# Altium project WatchDawg.PrjPCB
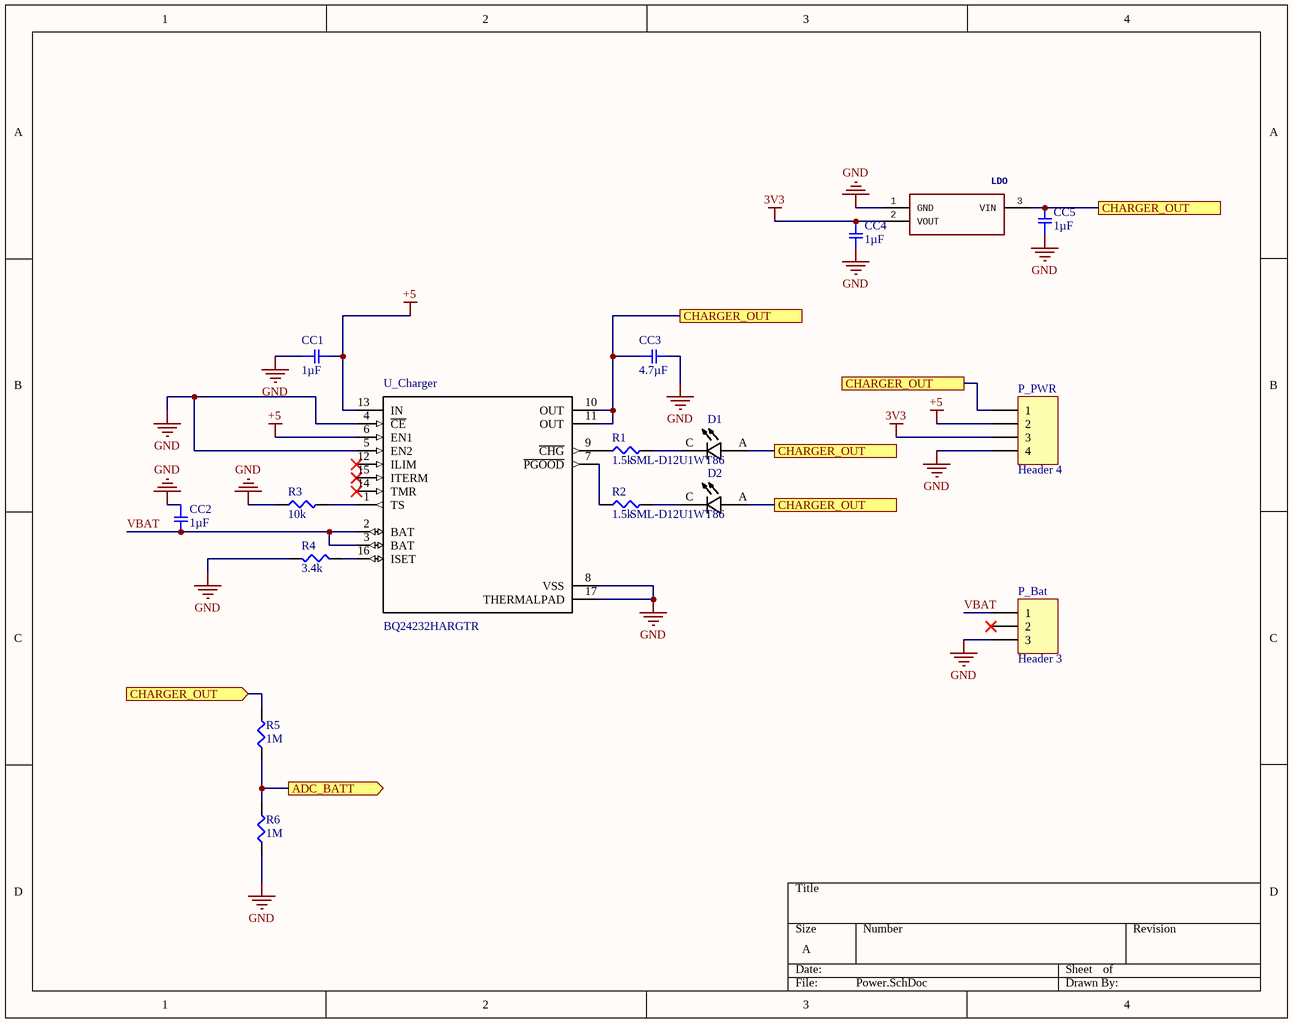
[diagram p0: Power.SchDoc]
6 sheets, 46 parts. Net scope: flat (ports and power ports of the same name join across sheets).
Board file: Board.PcbDoc
Sheets:
  Power.SchDoc
  MSP430.SchDoc
  Magnetometer.SchDoc
  EPaper.SchDoc
  GPS.SchDoc
  USB-FTDI.SchDoc

## Sheet Power.SchDoc
size A

### Parts
CC1  1µF  [SMD-0603C]
CC2  1µF  [SMD-0603C]
CC3  4.7µF  [SMD-0603C]
CC4  1µF  [SMD-0603C]
CC5  1µF  [SMD-0603C]
D1  SML-D12U1WT86  [*LED_SML-D12Y1WT86_SML-D12U1WT86(Primary)]
D2  SML-D12U1WT86  [*LED_SML-D12Y1WT86_SML-D12U1WT86(Primary)]
LDO  250mA 3.3V Ultra Low IQ LDO Reg. SOT23 DiodesZetex AP2138N-3.3TRG1, Low Noise LDO Voltage Regulator, 250 (Min)mA, 3.3 V +/-2%, 2.5 to 6.6 Vin, 3-Pin SOT-23Source:  Datasheet  [SOT95P282X145-3N]  (value not drawn)
P_Bat  Header 3  [HDR1X3]
P_PWR  Header 4  [HDR1X4]
R1  1.5k  [SMD-0603-RES]
R2  1.5k  [SMD-0603-RES]
R3  10k  [SMD-0603-RES]
R4  3.4k  [SMD-0603-RES]
R5  1M  [SMD-0603-RES]
R6  1M  [SMD-0603-RES]
U_Charger  BQ24232HARGTR  [*QFN50P300X300X100-17N]

### Ports
ADC_BATT (out), CHARGER_OUT, CHARGER_OUT (in)

### Nets
3V3: CC4.1 LDO.2(VOUT) P_PWR.3
+5: CC1.2 P_PWR.2 U_Charger.6(EN1) U_Charger.13(IN)
GND: CC1.1 CC2.1 CC3.2 CC4.2 CC5.1 LDO.1(GND) P_Bat.3 P_PWR.4 R3.1 R4.2 R6.1 U_Charger.4(~{CE}) U_Charger.5(EN2) U_Charger.8(VSS) U_Charger.17(THERMALPAD)
VBAT: CC2.2 P_Bat.1 U_Charger.2(BAT) U_Charger.3(BAT)
NetCC3_1: CC3.1 CC5.2 D1.A D2.A LDO.3(VIN) P_PWR.1 R5.2 U_Charger.10(OUT) U_Charger.11(OUT) ; port CHARGER_OUT
NetD1_C: D1.C R1.2
NetD2_C: D2.C R2.2
NetR1_1: R1.1 U_Charger.9(~{CHG})
NetR2_1: R2.1 U_Charger.7(~{PGOOD})
NetR3_2: R3.2 U_Charger.1(TS)
NetR4_1: R4.1 U_Charger.16(ISET)
NetR5_1: R5.1 R6.2 ; port ADC_BATT

Not connected (* = marked no-connect by the designer): P_Bat 2*; U_Charger 12(ILIM)* 14(TMR)* 15(ITERM)*

### Library data of the parts
CC1 CC2 CC4 CC5 = GRM188R61A105KA61D: CAP CER 1UF 10V X5R 0603; Manufacturer: Murata Electronics North America; Factory Stock: 0; Unit Price (USD): 0.1; Minimum Quantity: 1; Tolerance: ±10%; Datasheets: http://www.murata.com/~/media/webrenewal/support/library/catalog/products/capacitor/mlcc/c02e.pdf; Image: //media.digikey.com/Renders/Murata%20Renders/ZRB-SERIES-0402.jpg; Digi-Key Part Number: 490-1543-1-ND; Part Number: GRM188R61A105KA61D; Quantity Available: 2638296; @ qty: 0; Packaging: Cut Tape (CT); Series: GRM; Part Status: Active; Value: 1µF; Voltage: 10V; Temperature Coefficient: X5R; Operating Temperature: -55°C ~ 85°C; Features: -; Ratings: -; Applications: General Purpose; Mounting Type: Surface Mount, MLCC; Package / Case: 0603 (1608 Metric); Size / Dimension: 0.063" L x 0.031" W (1.60mm x 0.80mm); Height - Seated (Max): -; Thickness (Max): 0.035" (0.90mm); Lead Spacing: -; Lead Style: -
CC3 = GRM185R60G475ME15D: CAP CER 4.7UF 4V X5R 0603; Manufacturer: Murata Electronics North America; Factory Stock: 0; Unit Price (USD): 0.25; Minimum Quantity: 1; Tolerance: ±20%; Datasheets: http://www.murata.com/~/media/webrenewal/support/library/catalog/products/capacitor/mlcc/c02e.pdf; Image: //media.digikey.com/Renders/Murata%20Renders/ZRB-SERIES-0402.jpg; Digi-Key Part Number: 490-3891-1-ND; Part Number: GRM185R60G475ME15D; Quantity Available: 29936; @ qty: 0; Packaging: Cut Tape (CT); Series: GRM; Part Status: Active; Value: 4.7µF; Voltage: 4V; Temperature Coefficient: X5R; Operating Temperature: -55°C ~ 85°C; Features: -; Ratings: -; Applications: General Purpose; Mounting Type: Surface Mount, MLCC; Package / Case: 0603 (1608 Metric); Size / Dimension: 0.063" L x 0.031" W (1.60mm x 0.80mm); Height - Seated (Max): -; Thickness (Max): 0.020" (0.50mm); Lead Spacing: -; Lead Style: -
D1 D2 = SML-D12U1WT86: SML-D12 Series Red 0603 Diffused 63 mcd 2.2 V Surface Mount LED; MF: Rohm; Digi-Key_Purchase_URL: https://www.digikey.com/product-detail/en/rohm-semiconductor/SML-D12U1WT86/SML-D12U1WT86CT-ND/5843858?utm_source=snapeda&utm_medium=aggregator&utm_campaign=symbol; Digi-Key_Part_Number: SML-D12U1WT86CT-ND; Package: 0603 Rohm; SnapEDA_Link: https://www.snapeda.com/parts/SML-D12U1WT86/Rohm/view-part/?ref=snap; MP: SML-D12U1WT86; Value: *
LDO = AP2138N-3.3TRG1: Manufacturer_Name: Diodes Inc.; GateName_1: G$1; Allied_Number: 70551004; SymbolName_1: AP2138N-3.3TRG1; LibraryName: AP2138N-3.3TRG1; DeviceSetName: AP2138N-3.3TRG1; Package: SOT95P282X145-3N; Manufacturer_Part_Number: AP2138N-3.3TRG1; Mouser_Part_Number: 621-AP2138N-3.3TRG1; Mouser_Price-Stock: https://www.mouser.com/Search/Refine.aspx?Keyword=621-AP2138N-3.3TRG1; RS_Part_Number: 9210398P; RS_Price-Stock: http://uk.rs-online.com/web/p/products/9210398P; Allied_Price-Stock: https://www.alliedelec.com/diodesinc-ap2138n-3-3trg1/70551004/; Height: 1.45mm
P_Bat = Header 3: Header, 3-Pin; LatestRevisionDate: 17-Jul-2002; LatestRevisionNote: Re-released for DXP Platform.; Publisher: Altium Limited
P_PWR = Header 4: Header, 4-Pin; LatestRevisionDate: 17-Jul-2002; LatestRevisionNote: Re-released for DXP Platform.; Publisher: Altium Limited
R1 R2 = ERJ-3EKF1501V: RES SMD 1.5K OHM 1% 1/10W 0603; Manufacturer: Panasonic Electronic Components; Factory Stock: 0; Unit Price (USD): 0.00379; @ qty: 1500; Minimum Quantity: 1; Power (Watts): 0.1W, 1/10W; Temperature Coefficient: ±100ppm/°C; Part Number: ERJ-3EKF1501V; Datasheets: http://industrial.panasonic.com/www-cgi/jvcr13pz.cgi?E+PZ+3+AOA0002+ERJ3EKF1501V+7+WW; Image: //media.digikey.com/Photos/Panasonic%20Photos/MFG_ERJ-P6W%20Series.jpg; Digi-Key Part Number: P1.50KHCT-ND; Quantity Available: 417970; Packaging: Cut Tape (CT); Series: ERJ; Part Status: Active; Value: 1.5k; Tolerance: ±1%; Composition: Thick Film; Features: Automotive AEC-Q200; Operating Temperature: -55°C ~ 155°C; Package / Case: 0603 (1608 Metric); Supplier Device Package: 0603; Size / Dimension: 0.063" L x 0.031" W (1.60mm x 0.80mm); Height - Seated (Max): 0.022" (0.55mm); Number of Terminations: 2; Failure Rate: -
R3 = ERJ-PA3J103V: RES SMD 10K OHM 5% 1/4W 0603; Manufacturer: Panasonic Electronic Components; Factory Stock: 0; Unit Price (USD): 0.01646; @ qty: 1500; Minimum Quantity: 1; Power (Watts): 0.25W, 1/4W; Temperature Coefficient: ±200ppm/°C; Part Number: ERJ-PA3J103V; Datasheets: https://industrial.panasonic.com/cdbs/www-data/pdf/RDA0000/AOA0000C243.pdf; Image: //media.digikey.com/Photos/Panasonic%20Photos/MFG_ERJ-P6W%20Series.jpg; Digi-Key Part Number: P10KBZCT-ND; Quantity Available: 26345; Packaging: Cut Tape (CT); Series: ERJ; Part Status: Active; Value: 10k; Tolerance: ±5%; Composition: Thick Film; Features: Automotive AEC-Q200, Pulse Withstanding; Operating Temperature: -55°C ~ 155°C; Package / Case: 0603 (1608 Metric); Supplier Device Package: 0603; Size / Dimension: 0.063" L x 0.031" W (1.60mm x 0.80mm); Height - Seated (Max): 0.022" (0.55mm); Number of Terminations: 2; Failure Rate: -
R4 = ERJ-3EKF3401V: RES SMD 3.4K OHM 1% 1/10W 0603; Manufacturer: Panasonic Electronic Components; Factory Stock: 0; Unit Price (USD): 0.00379; @ qty: 1500; Minimum Quantity: 1; Power (Watts): 0.1W, 1/10W; Temperature Coefficient: ±100ppm/°C; Part Number: ERJ-3EKF3401V; Datasheets: http://industrial.panasonic.com/www-cgi/jvcr13pz.cgi?E+PZ+3+AOA0002+ERJ3EKF3401V+7+WW; Image: //media.digikey.com/Photos/Panasonic%20Photos/MFG_ERJ-P6W%20Series.jpg; Digi-Key Part Number: P3.40KHCT-ND; Quantity Available: 58954; Packaging: Cut Tape (CT); Series: ERJ; Part Status: Active; Value: 3.4k; Tolerance: ±1%; Composition: Thick Film; Features: Automotive AEC-Q200; Operating Temperature: -55°C ~ 155°C; Package / Case: 0603 (1608 Metric); Supplier Device Package: 0603; Size / Dimension: 0.063" L x 0.031" W (1.60mm x 0.80mm); Height - Seated (Max): 0.022" (0.55mm); Number of Terminations: 2; Failure Rate: -
R5 R6 = ERJ-3EKF1004V: RES SMD 1M OHM 1% 1/10W 0603; Manufacturer: Panasonic Electronic Components; Factory Stock: 0; Unit Price (USD): 0.00379; @ qty: 1500; Minimum Quantity: 1; Power (Watts): 0.1W, 1/10W; Temperature Coefficient: ±100ppm/°C; Part Number: ERJ-3EKF1004V; Datasheets: http://industrial.panasonic.com/www-cgi/jvcr13pz.cgi?E+PZ+3+AOA0002+ERJ3EKF1004V+7+WW; Image: //media.digikey.com/Photos/Panasonic%20Photos/MFG_ERJ-P6W%20Series.jpg; Digi-Key Part Number: P1.00MHCT-ND; Quantity Available: 1632074; Packaging: Cut Tape (CT); Series: ERJ; Part Status: Active; Value: 1M; Tolerance: ±1%; Composition: Thick Film; Features: Automotive AEC-Q200; Operating Temperature: -55°C ~ 155°C; Package / Case: 0603 (1608 Metric); Supplier Device Package: 0603; Size / Dimension: 0.063" L x 0.031" W (1.60mm x 0.80mm); Height - Seated (Max): 0.022" (0.55mm); Number of Terminations: 2; Failure Rate: -
U_Charger = BQ24232HARGTR: USB-Friendly Lithium-Ion Battery Charger and Power-Path Management IC 0.5A 10.5V OVP 16-Pin QFN T/R; MF: Texas Instruments; SnapEDA_Link: https://www.snapeda.com/parts/BQ24232HARGTR/Texas%20Instruments/view-part/?ref=snap; Digi-Key_Part_Number: 296-49554-1-ND; Digi-Key_Purchase_URL: https://www.digikey.com/product-detail/en/texas-instruments/BQ24232HARGTR/296-49554-1-ND/9462552?utm_source=snapeda&utm_medium=aggregator&utm_campaign=symbol; MP: BQ24232HARGTR; Package: VFQFN-16 Texas Instruments; Value: *

## Sheet MSP430.SchDoc
size A
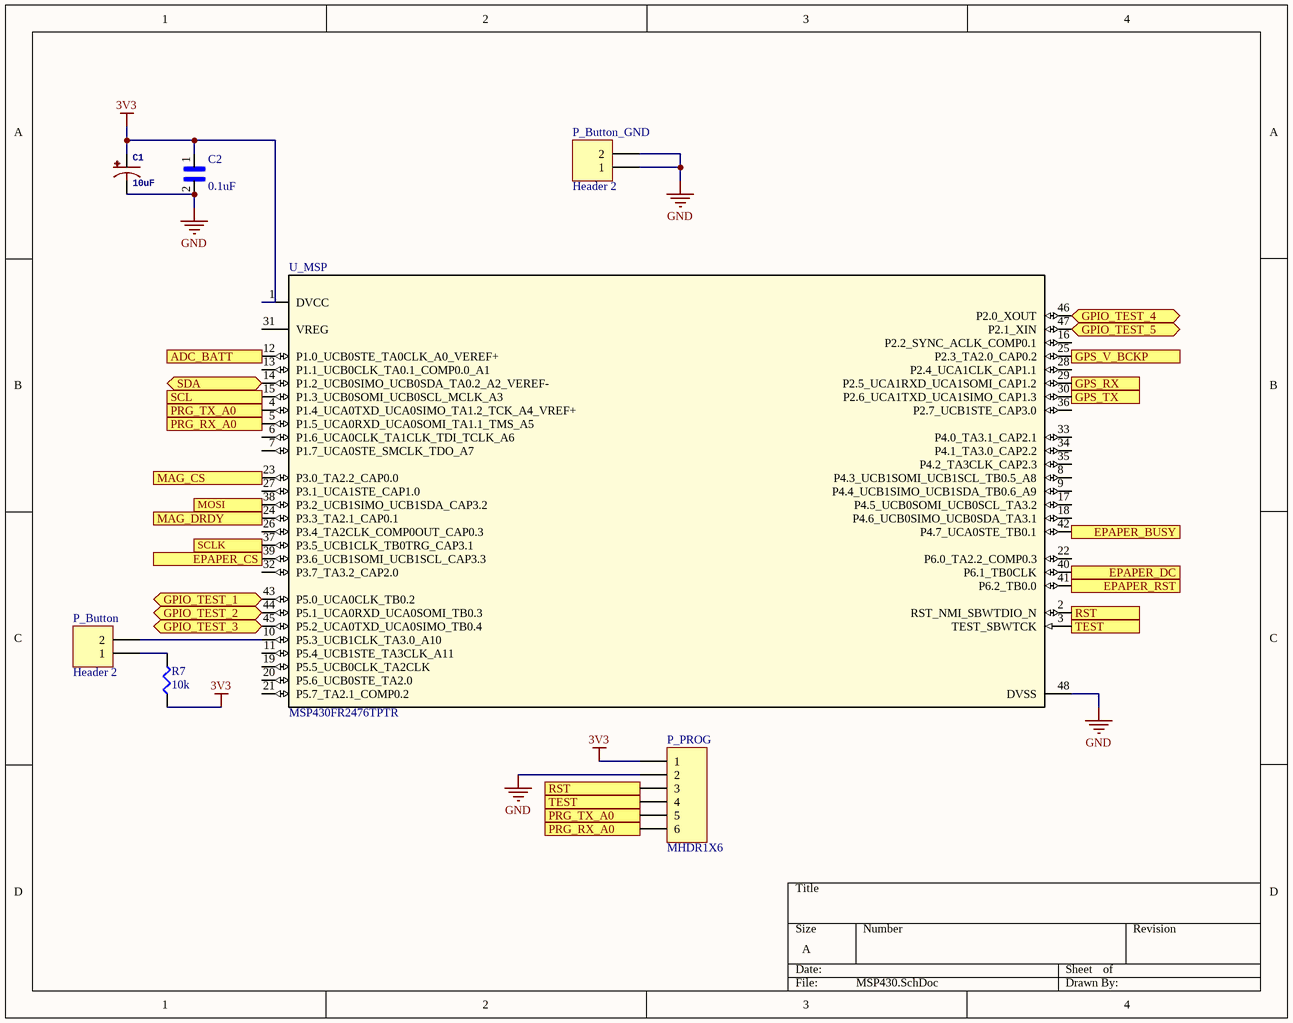
[diagram p1: MSP430.SchDoc]

### Parts
C1  10uF  [0603-POLAR]
C2  0.1uF  [*CAPC1608X90N]
P_Button  Header 2  [HDR1X2]
P_Button_GND  Header 2  [HDR1X2]
P_PROG  MHDR1X6  [MHDR1X6]
R7  10k  [SMD-0603-RES]
U_MSP  MSP430FR2476TPTR  [PT0048A_N]

### Ports
ADC_BATT (in), EPAPER_BUSY (out), EPAPER_CS (out), EPAPER_DC (out), EPAPER_RST (out), GPIO_TEST_1 (bidir), GPIO_TEST_2 (bidir), GPIO_TEST_3 (bidir), GPIO_TEST_4 (bidir), GPIO_TEST_5 (bidir), GPS_RX (in), GPS_TX (out), GPS_V_BCKP (out), MAG_CS (out), MAG_DRDY (out), MOSI (out), PRG_RX_A0 (in), PRG_RX_A0 (out), PRG_TX_A0 (in), PRG_TX_A0 (out), RST (in), RST (out), SCL (out), SCLK (out), SDA (bidir), TEST (in), TEST (out)

### Nets
3V3: C1.+ C2.1 P_PROG.1 R7.1 U_MSP.1(DVCC)
GND: C1.- C2.2 P_Button_GND.1 P_Button_GND.2 P_PROG.2 U_MSP.48(DVSS)
NetGC2_2: U_MSP.25(P2.3_TA2.0_CAP0.2) ; port GPS_V_BCKP
NetGR1_2: U_MSP.30(P2.6_UCA1TXD_UCA1SIMO_CAP1.3) ; port GPS_TX
NetGR2_2: U_MSP.29(P2.5_UCA1RXD_UCA1SOMI_CAP1.2) ; port GPS_RX
NetMR1_1: U_MSP.15(P1.3_UCB0SOMI_UCB0SCL_MCLK_A3) ; port SCL
NetMR2_2: U_MSP.14(P1.2_UCB0SIMO_UCB0SDA_TA0.2_A2_VEREF-) ; port SDA
NetP_Button_1: P_Button.1 R7.2
NetP_Button_2: P_Button.2 U_MSP.10(P5.3_UCB1CLK_TA3.0_A10)
NetP_EPAPER_1: U_MSP.47(P2.1_XIN) ; port GPIO_TEST_5
NetP_EPAPER_2: U_MSP.46(P2.0_XOUT) ; port GPIO_TEST_4
NetP_EPAPER_3: U_MSP.45(P5.2_UCA0TXD_UCA0SIMO_TB0.4) ; port GPIO_TEST_3
NetP_EPAPER_4: U_MSP.44(P5.1_UCA0RXD_UCA0SOMI_TB0.3) ; port GPIO_TEST_2
NetP_EPAPER_5: U_MSP.43(P5.0_UCA0CLK_TB0.2) ; port GPIO_TEST_1
NetP_EPAPER_6: U_MSP.42(P4.7_UCA0STE_TB0.1) ; port EPAPER_BUSY
NetP_EPAPER_7: U_MSP.41(P6.2_TB0.0) ; port EPAPER_RST
NetP_EPAPER_8: U_MSP.40(P6.1_TB0CLK) ; port EPAPER_DC
NetP_EPAPER_9: U_MSP.39(P3.6_UCB1SOMI_UCB1SCL_CAP3.3) ; port EPAPER_CS
NetP_EPAPER_10: U_MSP.37(P3.5_UCB1CLK_TB0TRG_CAP3.1) ; port SCLK
NetP_EPAPER_11: U_MSP.38(P3.2_UCB1SIMO_UCB1SDA_CAP3.2) ; port MOSI
NetP_PROG_3: P_PROG.3 U_MSP.2(RST_NMI_SBWTDIO_N) ; port RST
NetP_PROG_4: P_PROG.4 U_MSP.3(TEST_SBWTCK) ; port TEST
NetP_PROG_5: P_PROG.5 U_MSP.4(P1.4_UCA0TXD_UCA0SIMO_TA1.2_TCK_A4_VREF+) ; port PRG_TX_A0
NetP_PROG_6: P_PROG.6 U_MSP.5(P1.5_UCA0RXD_UCA0SOMI_TA1.1_TMS_A5) ; port PRG_RX_A0
NetR5_1: U_MSP.12(P1.0_UCB0STE_TA0CLK_A0_VEREF+) ; port ADC_BATT
NetU_MAG_8: U_MSP.24(P3.3_TA2.1_CAP0.1) ; port MAG_DRDY
NetU_MAG_10: U_MSP.23(P3.0_TA2.2_CAP0.0) ; port MAG_CS

Not connected (* = marked no-connect by the designer): U_MSP 6(P1.6_UCA0CLK_TA1CLK_TDI_TCLK_A6) 7(P1.7_UCA0STE_SMCLK_TDO_A7) 8(P4.3_UCB1SOMI_UCB1SCL_TB0.5_A8) 9(P4.4_UCB1SIMO_UCB1SDA_TB0.6_A9) 11(P5.4_UCB1STE_TA3CLK_A11) 13(P1.1_UCB0CLK_TA0.1_COMP0.0_A1) 16(P2.2_SYNC_ACLK_COMP0.1) 17(P4.5_UCB0SOMI_UCB0SCL_TA3.2) 18(P4.6_UCB0SIMO_UCB0SDA_TA3.1) 19(P5.5_UCB0CLK_TA2CLK) 20(P5.6_UCB0STE_TA2.0) 21(P5.7_TA2.1_COMP0.2) 22(P6.0_TA2.2_COMP0.3) 26(P3.4_TA2CLK_COMP0OUT_CAP0.3) 27(P3.1_UCA1STE_CAP1.0) 28(P2.4_UCA1CLK_CAP1.1) 31(VREG) 32(P3.7_TA3.2_CAP2.0) 33(P4.0_TA3.1_CAP2.1) 34(P4.1_TA3.0_CAP2.2) 35(P4.2_TA3CLK_CAP2.3) 36(P2.7_UCB1STE_CAP3.0)

### Library data of the parts
C1 = 10UF-POLAR-0603-6.3V-20%(TANT): GateName_1: G$1; SymbolName_1: CAP_POL; PROD_ID: CAP-13210; DeviceName: -0603-6.3V-20%(TANT); LibraryName: SparkFun-Capacitors; DeviceSetName: 10UF-POLAR; Package: 0603-POLAR
C2 = GMK107BJ104KAHT: CAP , MLCC , 0603, 35V , X5R, 0.1uF10% , T&R; MF: Taiyo Yuden; Package: 1608 Taiyo Yuden; Digi-Key_Purchase_URL: https://www.digikey.com/product-detail/en/taiyo-yuden/GMK107BJ104KAHT/587-3357-1-ND/4157244?utm_source=snapeda&utm_medium=aggregator&utm_campaign=symbol; Digi-Key_Part_Number: 587-3357-1-ND; SnapEDA_Link: https://www.snapeda.com/parts/GMK107BJ104KAHT/Taiyo%20Yuden/view-part/?ref=snap; MP: GMK107BJ104KAHT; Value: *
P_Button P_Button_GND = Header 2: Header, 2-Pin; LatestRevisionDate: 17-Jul-2002; LatestRevisionNote: Re-released for DXP Platform.; Publisher: Altium Limited
P_PROG = MHDR1X6: Header, 6-Pin; LatestRevisionDate: 17-Jul-2002; LatestRevisionNote: Re-released for DXP Platform.; Publisher: Altium Limited
R7 = ERJ-PA3F1002V: RES SMD 10K OHM 1% 1/4W 0603; Manufacturer: Panasonic Electronic Components; Factory Stock: 0; Unit Price (USD): 0.02372; @ qty: 1500; Minimum Quantity: 1; Power (Watts): 0.25W, 1/4W; Temperature Coefficient: ±100ppm/°C; Part Number: ERJ-PA3F1002V; Datasheets: https://industrial.panasonic.com/cdbs/www-data/pdf/RDA0000/AOA0000C243.pdf; Image: //media.digikey.com/Photos/Panasonic%20Photos/MFG_ERJ-P6W%20Series.jpg; Digi-Key Part Number: P10KBYCT-ND; Quantity Available: 12488; Packaging: Cut Tape (CT); Series: ERJ; Part Status: Active; Value: 10k; Tolerance: ±1%; Composition: Thick Film; Features: Automotive AEC-Q200, Pulse Withstanding; Operating Temperature: -55°C ~ 155°C; Package / Case: 0603 (1608 Metric); Supplier Device Package: 0603; Size / Dimension: 0.063" L x 0.031" W (1.60mm x 0.80mm); Height - Seated (Max): 0.022" (0.55mm); Number of Terminations: 2; Failure Rate: -
U_MSP = MSP430FR2476TPTR: Imported; Manufacturer: Texas Instruments; PartNumber: MSP430FR2476TPTR; RefDes: RefDes; TYPE: TYPE; Value: Value

## Sheet Magnetometer.SchDoc
size A
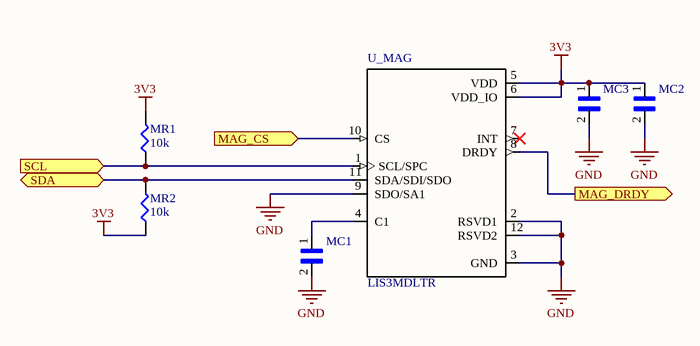
[diagram p2: Magnetometer.SchDoc]

### Parts
MC1  GMK107BJ104KAHT  [*CAPC1608X90N]  (value not drawn)
MC2  TACL105K016XTA  [*CAPC1608X90]  (value not drawn)
MC3  GMK107BJ104KAHT  [*CAPC1608X90N]  (value not drawn)
MR1  10k  [SMD-0603-RES]
MR2  10k  [SMD-0603-RES]
U_MAG  LIS3MDLTR  [*XDCR_LIS3MDLTR]

### Ports
MAG_CS (in), MAG_DRDY (out), SCL (in), SDA (bidir)

### Nets
3V3: MC2.1 MC3.1 MR1.2 MR2.1 U_MAG.5(VDD) U_MAG.6(VDD_IO)
GND: MC1.2 MC2.2 MC3.2 U_MAG.2(RSVD1) U_MAG.3(GND) U_MAG.9(SDO/SA1) U_MAG.12(RSVD2)
NetMC1_1: MC1.1 U_MAG.4(C1)
NetMR1_1: MR1.1 U_MAG.1(SCL/SPC) ; port SCL
NetMR2_2: MR2.2 U_MAG.11(SDA/SDI/SDO) ; port SDA
NetU_MAG_8: U_MAG.8(DRDY) ; port MAG_DRDY
NetU_MAG_10: U_MAG.10(CS) ; port MAG_CS

Not connected (* = marked no-connect by the designer): U_MAG 7(INT)*

### Library data of the parts
MC1 MC3 = GMK107BJ104KAHT: as C2 on sheet MSP430; Package: 1608 Taiyo Yuden; Digi-Key_Purchase_URL: https://www.digikey.com/product-detail/en/taiyo-yuden/GMK107BJ104KAHT/587-3357-1-ND/4157244?utm_source=snapeda&utm_medium=aggregator&utm_campaign=symbol; Digi-Key_Part_Number: 587-3357-1-ND; SnapEDA_Link: https://www.snapeda.com/parts/GMK107BJ104KAHT/Taiyo%20Yuden/view-part/?ref=snap; MP: GMK107BJ104KAHT; Value: *
MC2 = TACL105K016XTA: Cap Tant Solid 1uF 16V L CASE 10% _1.6 X 0.85 X 0.85mm_ SMD 1608-10 7.5 Ohm 125Â°C Plastic T/R; MF: AVX; Digi-Key_Purchase_URL: https://www.digikey.com/product-detail/en/avx-corporation/TACL105K016XTA/478-4184-1-ND/1212747?utm_source=snapeda&utm_medium=aggregator&utm_campaign=symbol; Digi-Key_Part_Number: 478-4184-1-ND; Package: 0603 AVX; SnapEDA_Link: https://www.snapeda.com/parts/TACL105K016XTA/AVX%20/%20Kyocera/view-part/?ref=snap; MP: TACL105K016XTA; Value: *
MR1 MR2 = ERJ-PA3J103V: as R3 on sheet Power; Part Number: ERJ-PA3J103V; Datasheets: https://industrial.panasonic.com/cdbs/www-data/pdf/RDA0000/AOA0000C243.pdf; Image: //media.digikey.com/Photos/Panasonic%20Photos/MFG_ERJ-P6W%20Series.jpg; Digi-Key Part Number: P10KBZCT-ND; Quantity Available: 26345; Packaging: Cut Tape (CT); Series: ERJ; Part Status: Active; Value: 10k; Tolerance: ±5%; Composition: Thick Film; Features: Automotive AEC-Q200, Pulse Withstanding; Operating Temperature: -55°C ~ 155°C; Package / Case: 0603 (1608 Metric); Supplier Device Package: 0603; Size / Dimension: 0.063" L x 0.031" W (1.60mm x 0.80mm); Height - Seated (Max): 0.022" (0.55mm); Number of Terminations: 2; Failure Rate: -
U_MAG = LIS3MDLTR: LIS3MDL Series 3 Axis Â±2/Â±8/Â±12/Â±16 g 3.6V High Performance Magnetometer LGA-12; MF: STMicroelectronics; SnapEDA_Link: https://www.snapeda.com/parts/LIS3MDLTR/STMicroelectronics/view-part/?ref=snap; Digi-Key_Part_Number: 497-13892-1-ND; Digi-Key_Purchase_URL: https://www.digikey.com/product-detail/en/stmicroelectronics/LIS3MDLTR/497-13892-1-ND/4309737?utm_source=snapeda&utm_medium=aggregator&utm_campaign=symbol; Package: VFLGA-12 STMicroelectronics; MP: LIS3MDLTR; Value: *

## Sheet EPaper.SchDoc
size A
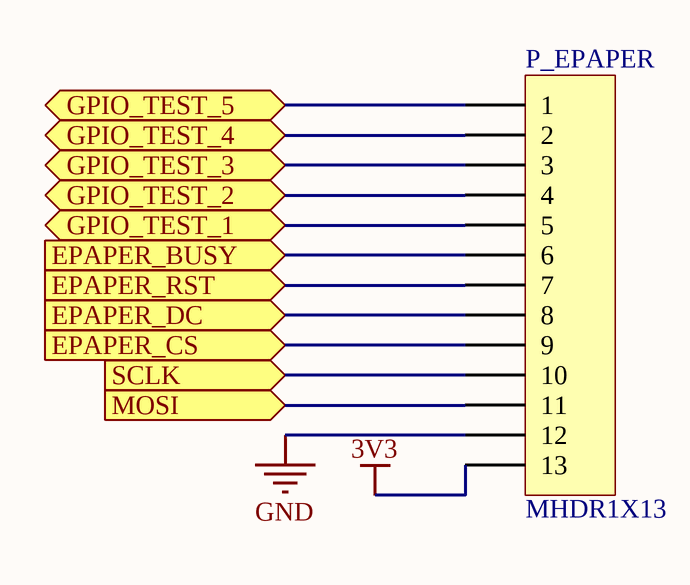
[diagram p3: EPaper.SchDoc]

### Parts
P_EPAPER  MHDR1X13  [MHDR1X13]

### Ports
EPAPER_BUSY (in), EPAPER_CS (in), EPAPER_DC (in), EPAPER_RST (in), GPIO_TEST_1 (bidir), GPIO_TEST_2 (bidir), GPIO_TEST_3 (bidir), GPIO_TEST_4 (bidir), GPIO_TEST_5 (bidir), MOSI (in), SCLK (in)

### Nets
3V3: P_EPAPER.13
GND: P_EPAPER.12
NetP_EPAPER_1: P_EPAPER.1 ; port GPIO_TEST_5
NetP_EPAPER_2: P_EPAPER.2 ; port GPIO_TEST_4
NetP_EPAPER_3: P_EPAPER.3 ; port GPIO_TEST_3
NetP_EPAPER_4: P_EPAPER.4 ; port GPIO_TEST_2
NetP_EPAPER_5: P_EPAPER.5 ; port GPIO_TEST_1
NetP_EPAPER_6: P_EPAPER.6 ; port EPAPER_BUSY
NetP_EPAPER_7: P_EPAPER.7 ; port EPAPER_RST
NetP_EPAPER_8: P_EPAPER.8 ; port EPAPER_DC
NetP_EPAPER_9: P_EPAPER.9 ; port EPAPER_CS
NetP_EPAPER_10: P_EPAPER.10 ; port SCLK
NetP_EPAPER_11: P_EPAPER.11 ; port MOSI

### Library data of the parts
P_EPAPER = MHDR1X13: Header, 13-Pin; LatestRevisionDate: 17-Jul-2002; LatestRevisionNote: Re-released for DXP Platform.; Publisher: Altium Limited

## Sheet GPS.SchDoc
size A
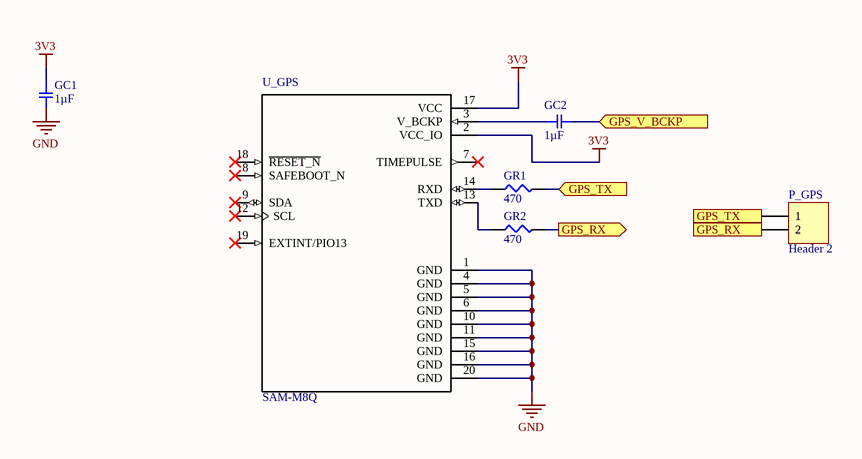
[diagram p4: GPS.SchDoc]

### Parts
GC1  1µF  [SMD-0603C]
GC2  1µF  [SMD-0603C]
GR1  470  [SMD-0603-RES]
GR2  470  [SMD-0603-RES]
P_GPS  Header 2  [HDR1X2]
U_GPS  SAM-M8Q  [*XCVR_SAM-M8Q]

### Ports
GPS_RX (out), GPS_TX (in), GPS_TX (out), GPS_V_BCKP (in)

### Nets
3V3: GC1.1 U_GPS.2(VCC_IO) U_GPS.17(VCC)
GND: GC1.2 U_GPS.1(GND) U_GPS.4(GND) U_GPS.5(GND) U_GPS.6(GND) U_GPS.10(GND) U_GPS.11(GND) U_GPS.15(GND) U_GPS.16(GND) U_GPS.20(GND)
NetGC2_1: GC2.1 U_GPS.3(V_BCKP)
NetGC2_2: GC2.2 ; port GPS_V_BCKP
NetGR1_1: GR1.1 U_GPS.14(RXD)
NetGR1_2: GR1.2 P_GPS.1 ; port GPS_TX
NetGR2_1: GR2.1 U_GPS.13(TXD)
NetGR2_2: GR2.2 P_GPS.2 ; port GPS_RX

Not connected (* = marked no-connect by the designer): U_GPS 7(TIMEPULSE)* 8(SAFEBOOT_N)* 9(SDA)* 12(SCL)* 18(~{RESET_N})* 19(EXTINT/PIO13)*

### Library data of the parts
GC1 GC2 = GRM188R61A105KA61D: as CC1 on sheet Power; Datasheets: http://www.murata.com/~/media/webrenewal/support/library/catalog/products/capacitor/mlcc/c02e.pdf; Image: //media.digikey.com/Renders/Murata%20Renders/ZRB-SERIES-0402.jpg; Digi-Key Part Number: 490-1543-1-ND; Part Number: GRM188R61A105KA61D; Quantity Available: 2638296; @ qty: 0; Packaging: Cut Tape (CT); Series: GRM; Part Status: Active; Value: 1µF; Voltage: 10V; Temperature Coefficient: X5R; Operating Temperature: -55°C ~ 85°C; Features: -; Ratings: -; Applications: General Purpose; Mounting Type: Surface Mount, MLCC; Package / Case: 0603 (1608 Metric); Size / Dimension: 0.063" L x 0.031" W (1.60mm x 0.80mm); Height - Seated (Max): -; Thickness (Max): 0.035" (0.90mm); Lead Spacing: -; Lead Style: -
GR1 GR2 = ERJ-3EKF4700V: RES SMD 470 OHM 1% 1/10W 0603; Manufacturer: Panasonic Electronic Components; Factory Stock: 0; Unit Price (USD): 0.00379; @ qty: 1500; Minimum Quantity: 1; Power (Watts): 0.1W, 1/10W; Temperature Coefficient: ±100ppm/°C; Part Number: ERJ-3EKF4700V; Datasheets: http://industrial.panasonic.com/www-cgi/jvcr13pz.cgi?E+PZ+3+AOA0002+ERJ3EKF4700V+7+WW; Image: //media.digikey.com/Photos/Panasonic%20Photos/MFG_ERJ-P6W%20Series.jpg; Digi-Key Part Number: P470HCT-ND; Quantity Available: 553629; Packaging: Cut Tape (CT); Series: ERJ; Part Status: Active; Value: 470; Tolerance: ±1%; Composition: Thick Film; Features: Automotive AEC-Q200; Operating Temperature: -55°C ~ 155°C; Package / Case: 0603 (1608 Metric); Supplier Device Package: 0603; Size / Dimension: 0.063" L x 0.031" W (1.60mm x 0.80mm); Height - Seated (Max): 0.022" (0.55mm); Number of Terminations: 2; Failure Rate: -
P_GPS = Header 2: Header, 2-Pin; LatestRevisionDate: 17-Jul-2002; LatestRevisionNote: Re-released for DXP Platform.; Publisher: Altium Limited
U_GPS = SAM-M8Q: u-Blox M8 Gnss Antenna Module; MF: U-Blox America; Digi-Key_Purchase_URL: https://www.digikey.com/product-detail/en/u-blox-america-inc/SAM-M8Q-0-10/672-1054-1-ND/7393573?utm_source=snapeda&utm_medium=aggregator&utm_campaign=symbol; Package: SMD-20 U-Blox America; MP: SAM-M8Q; SnapEDA_Link: https://www.snapeda.com/parts/SAM-M8Q/U-Blox%20America%20Inc./view-part/?ref=snap; Digi-Key_Part_Number: 672-1054-1-ND; Value: *

## Sheet USB-FTDI.SchDoc
size A
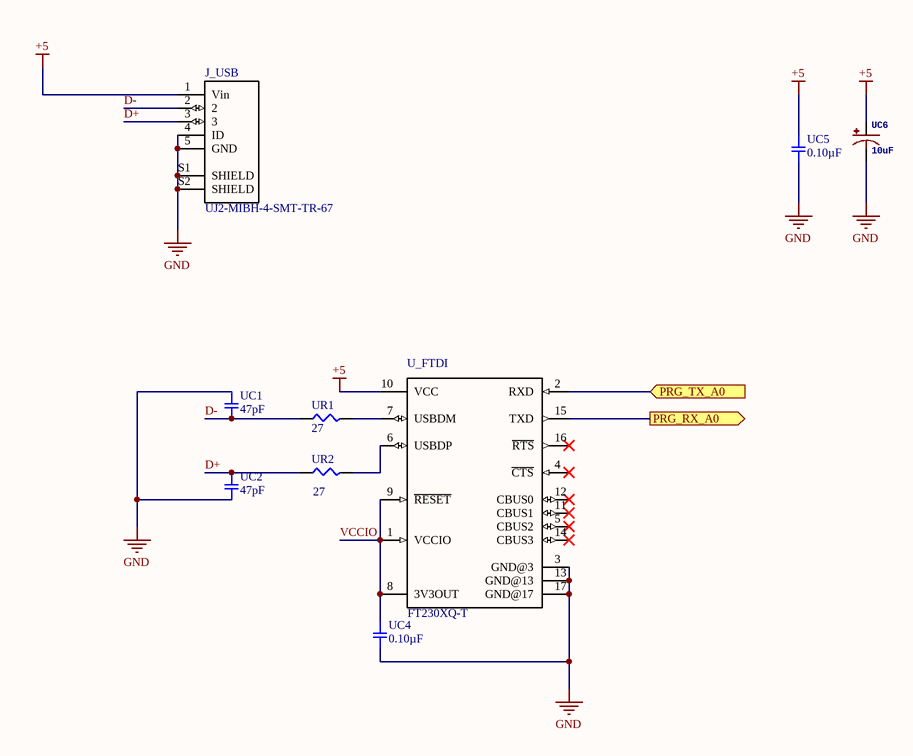
[diagram p5: USB-FTDI.SchDoc]

### Parts
J_USB  UJ2-MIBH-4-SMT-TR-67  [*CUI_UJ2-MIBH-4-SMT-TR-67_UJ2-MIBH-4-SMT-TR-67(Primary)]
U_FTDI  FT230XQ-T  [*QFN16]
UC1  47pF  [SMD-0603C]
UC2  47pF  [SMD-0603C]
UC4  0.10µF  [SMD-0603C]
UC5  0.10µF  [SMD-0603C]
UC6  10uF  [0603-POLAR]
UR1  27  [SMD-0603-RES]
UR2  27  [SMD-0603-RES]

### Ports
PRG_RX_A0 (out), PRG_TX_A0 (in)

### Nets
+5: J_USB.1(Vin) U_FTDI.10(VCC) UC5.1 UC6.+
GND: J_USB.4(ID) J_USB.5(GND) J_USB.S1(SHIELD) J_USB.S2(SHIELD) U_FTDI.3(GND@3) U_FTDI.13(GND@13) U_FTDI.17(GND@17) UC1.1 UC2.2 UC4.2 UC5.2 UC6.-
D+: J_USB.3 UC2.1 UR2.1
D-: J_USB.2 UC1.2 UR1.1
VCCIO: U_FTDI.1(VCCIO) U_FTDI.8(3V3OUT) U_FTDI.9(~{RESET}) UC4.1
NetP_PROG_5: U_FTDI.2(RXD) ; port PRG_TX_A0
NetP_PROG_6: U_FTDI.15(TXD) ; port PRG_RX_A0
NetU_FTDI_6: U_FTDI.6(USBDP) UR2.2
NetU_FTDI_7: U_FTDI.7(USBDM) UR1.2

Not connected (* = marked no-connect by the designer): U_FTDI 4(~{CTS})* 5(CBUS2)* 11(CBUS1)* 12(CBUS0)* 14(CBUS3)* 16(~{RTS})*

### Library data of the parts
J_USB = UJ2-MIBH-4-SMT-TR-67: Micro B, USB 2.0, 1.8 A, Right Angle, Surface Mount _SMT_, Waterproof, USB Receptacle; MF: CUI Devices; Digi-Key_Purchase_URL: https://www.digikey.com/product-detail/en/cui-devices/UJ2-MIBH-4-SMT-TR-67/102-4970-1-ND/9564435?utm_source=snapeda&utm_medium=aggregator&utm_campaign=symbol; CUI_purchase_URL: https://www.cuidevices.com/product/interconnect/connectors/usb-connectors/uj2-mibh-4-smt-tr-67?utm_source=snapeda.com&utm_medium=referral&utm_campaign=snapedaBOM; Package: None; MP: UJ2-MIBH-4-SMT-TR-67; SnapEDA_Link: https://www.snapeda.com/parts/UJ2-MIBH-4-SMT-TR-67/CUI%20Devices/view-part/?ref=snap; Digi-Key_Part_Number: 102-4970-1-ND; Value: *
U_FTDI = FT230XQ-T: USB Full Speed to Basic UART IC with USB Charger Detection, QFN-16; MF: FTDI,; MP: FT230XQ-T; Digi-Key_Purchase_URL: https://www.digikey.com/product-detail/en/ftdi-future-technology-devices-international-ltd/FT230XQ-T/768-1153-ND/3749474?utm_source=snapeda&utm_medium=aggregator&utm_campaign=symbol; Package: QFN-16 FTDI; SnapEDA_Link: https://www.snapeda.com/parts/FT230XQ-T/FTDI%2C%20Future%20Technology%20Devices%20International%20Ltd/view-part/?ref=snap; Digi-Key_Part_Number: 768-1153-ND; Value: *
UC1 UC2 = GCM1885C2A470JA16D: CAP CER 47PF 100V NP0 0603; Manufacturer: Murata Electronics North America; Factory Stock: 0; Unit Price (USD): 0.1; Minimum Quantity: 1; Tolerance: ±5%; Temperature Coefficient: C0G, NP0; Datasheets: http://www.murata.com/~/media/webrenewal/support/library/catalog/products/capacitor/mlcc/c03e.ashx; Image: //media.digikey.com/Renders/Murata%20Renders/0603%28GCM188%29.jpg; Digi-Key Part Number: 490-4944-1-ND; Part Number: GCM1885C2A470JA16D; Quantity Available: 586; @ qty: 0; Packaging: Cut Tape (CT); Series: GCM; Part Status: Active; Value: 47pF; Voltage: 100V; Operating Temperature: -55°C ~ 125°C; Features: -; Ratings: AEC-Q200; Applications: Automotive; Mounting Type: Surface Mount, MLCC; Package / Case: 0603 (1608 Metric); Size / Dimension: 0.063" L x 0.031" W (1.60mm x 0.80mm); Height - Seated (Max): -; Thickness (Max): 0.035" (0.90mm); Lead Spacing: -; Lead Style: -
UC4 UC5 = GCM188R71C104KA37D: CAP CER 0.1UF 16V X7R 0603; Manufacturer: Murata Electronics North America; Factory Stock: 0; Unit Price (USD): 0.18; Minimum Quantity: 1; Tolerance: ±10%; Datasheets: http://www.murata.com/~/media/webrenewal/support/library/catalog/products/capacitor/mlcc/c03e.ashx; Image: //media.digikey.com/Renders/Murata%20Renders/0603%28GCM188%29.jpg; Digi-Key Part Number: 490-4774-1-ND; Part Number: GCM188R71C104KA37D; Quantity Available: 284085; @ qty: 0; Packaging: Cut Tape (CT); Series: GCM; Part Status: Active; Value: 0.10µF; Voltage: 16V; Temperature Coefficient: X7R; Operating Temperature: -55°C ~ 125°C; Features: -; Ratings: AEC-Q200; Applications: Automotive; Mounting Type: Surface Mount, MLCC; Package / Case: 0603 (1608 Metric); Size / Dimension: 0.063" L x 0.031" W (1.60mm x 0.80mm); Height - Seated (Max): -; Thickness (Max): 0.035" (0.90mm); Lead Spacing: -; Lead Style: -
UC6 = 10UF-POLAR-0603-6.3V-20%(TANT): as C1 on sheet MSP430; DeviceName: -0603-6.3V-20%(TANT); LibraryName: SparkFun-Capacitors; DeviceSetName: 10UF-POLAR; Package: 0603-POLAR
UR1 UR2 = ERJ-3EKF27R0V: RES SMD 27 OHM 1% 1/10W 0603; Manufacturer: Panasonic Electronic Components; Factory Stock: 0; Unit Price (USD): 0.00379; @ qty: 1500; Minimum Quantity: 1; Power (Watts): 0.1W, 1/10W; Temperature Coefficient: ±100ppm/°C; Part Number: ERJ-3EKF27R0V; Datasheets: http://industrial.panasonic.com/www-cgi/jvcr13pz.cgi?E+PZ+3+AOA0002+ERJ3EKF27R0V+7+WW; Image: //media.digikey.com/Photos/Panasonic%20Photos/MFG_ERJ-P6W%20Series.jpg; Digi-Key Part Number: P27.0HCT-ND; Quantity Available: 283006; Packaging: Cut Tape (CT); Series: ERJ; Part Status: Active; Value: 27; Tolerance: ±1%; Composition: Thick Film; Features: Automotive AEC-Q200; Operating Temperature: -55°C ~ 155°C; Package / Case: 0603 (1608 Metric); Supplier Device Package: 0603; Size / Dimension: 0.063" L x 0.031" W (1.60mm x 0.80mm); Height - Seated (Max): 0.022" (0.55mm); Number of Terminations: 2; Failure Rate: -

## Nets that join several sheets
3V3: Power (CC4.1 LDO.2 P_PWR.3), MSP430 (5 pins), Magnetometer (6 pins), EPaper (P_EPAPER.13), GPS (GC1.1 U_GPS.2 U_GPS.17)
+5: Power (CC1.2 P_PWR.2 U_Charger.6 U_Charger.13), USB-FTDI (J_USB.1 U_FTDI.10 UC5.1 UC6.+)
GND: Power (15 pins), MSP430 (6 pins), Magnetometer (7 pins), EPaper (P_EPAPER.12), GPS (10 pins), USB-FTDI (12 pins)
NetGC2_2: MSP430 (U_MSP.25), GPS (GC2.2)
NetGR1_2: MSP430 (U_MSP.30), GPS (GR1.2 P_GPS.1)
NetGR2_2: MSP430 (U_MSP.29), GPS (GR2.2 P_GPS.2)
NetMR1_1: MSP430 (U_MSP.15), Magnetometer (MR1.1 U_MAG.1)
NetMR2_2: MSP430 (U_MSP.14), Magnetometer (MR2.2 U_MAG.11)
NetP_EPAPER_1: MSP430 (U_MSP.47), EPaper (P_EPAPER.1)
NetP_EPAPER_2: MSP430 (U_MSP.46), EPaper (P_EPAPER.2)
NetP_EPAPER_3: MSP430 (U_MSP.45), EPaper (P_EPAPER.3)
NetP_EPAPER_4: MSP430 (U_MSP.44), EPaper (P_EPAPER.4)
NetP_EPAPER_5: MSP430 (U_MSP.43), EPaper (P_EPAPER.5)
NetP_EPAPER_6: MSP430 (U_MSP.42), EPaper (P_EPAPER.6)
NetP_EPAPER_7: MSP430 (U_MSP.41), EPaper (P_EPAPER.7)
NetP_EPAPER_8: MSP430 (U_MSP.40), EPaper (P_EPAPER.8)
NetP_EPAPER_9: MSP430 (U_MSP.39), EPaper (P_EPAPER.9)
NetP_EPAPER_10: MSP430 (U_MSP.37), EPaper (P_EPAPER.10)
NetP_EPAPER_11: MSP430 (U_MSP.38), EPaper (P_EPAPER.11)
NetP_PROG_5: MSP430 (P_PROG.5 U_MSP.4), USB-FTDI (U_FTDI.2)
NetP_PROG_6: MSP430 (P_PROG.6 U_MSP.5), USB-FTDI (U_FTDI.15)
NetR5_1: Power (R5.1 R6.2), MSP430 (U_MSP.12)
NetU_MAG_8: MSP430 (U_MSP.24), Magnetometer (U_MAG.8)
NetU_MAG_10: MSP430 (U_MSP.23), Magnetometer (U_MAG.10)